# Altium schematic sheet Tray2_Comms_AFSK.SchDoc: BLUEsat AFSK Modem
size A3; DrawnBy: Mitch Wenke, Chris Webb, Thomas Fisk; Engineer: C. WEBB, M. WENKE; Organization: BLUEsat Project; Address1: Room 419; Address2: School of EE&T; Address3: UNSW, NSW 2052; Address4: Australia; DocumentNumber: COMS0002; SheetNumber: 1; SheetTotal: 1; Description: AFSK modem based on CML MX614 IC; Version: 1.0
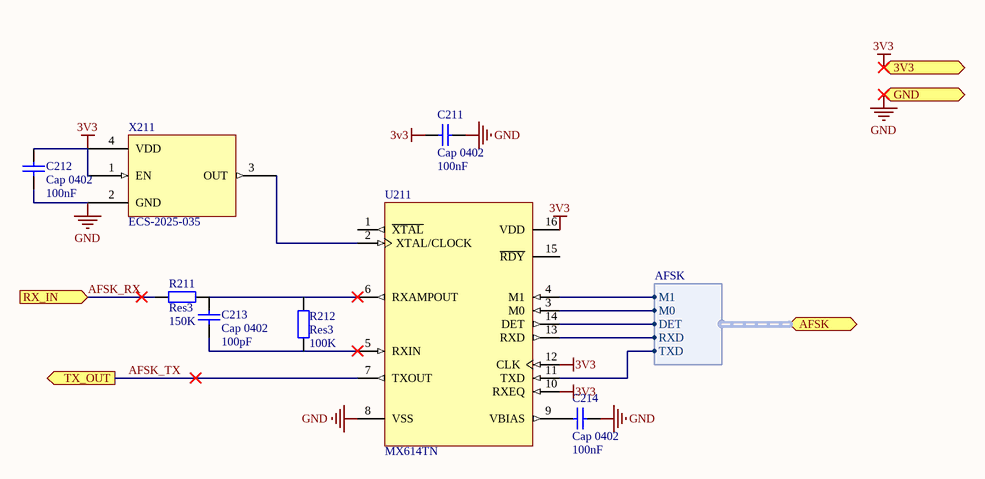
[diagram p0: Tray2_Comms_AFSK.SchDoc]

## Parts
C211  Cap 0402  value 100nF  [CAPC1005X06L]
C212  Cap 0402  value 100nF  [CAPC1005X06L]
C213  Cap 0402  value 100pF  [CAPC1005X06L]
C214  Cap 0402  value 100nF  [CAPC1005X06L]
R211  Res3  value 150K  [RESC1005X06L]
R212  Res3  value 100K  [RESC1005X06L]
U211  MX614TN  [SOIC16]
X211  ECS-2025-035  [ECS-2025]

## Ports
3V3 (in), AFSK (harness AFSK), GND (in), RX_IN (in), TX_OUT (out)

## Harnesses
AFSK: DET, M0, M1, RXD, TXD

## Nets
3V3: C211.2 C212.2 U211.10(RXEQ) U211.12(CLK) U211.16(VDD) X211.1(EN) X211.4(VDD) ; port 3V3
GND: C211.1 C212.1 C214.1 U211.8(VSS) X211.2(GND) ; port GND
AFSK_RX: R211.2 ; port RX_IN
AFSK_TX: U211.7(TXOUT) ; port TX_OUT
NetC213_1: C213.1 R212.2 U211.5(RXIN)
NetC213_2: C213.2 R211.1 R212.1 U211.6(RXAMPOUT)
NetC214_2: C214.2 U211.9(VBIAS)
NetU211_2: U211.2(XTAL/CLOCK) X211.3(OUT)
NetU211_3: U211.3(M0) ; port AFSK.M0
NetU211_4: U211.4(M1) ; port AFSK.M1
NetU211_11: U211.11(TXD) ; port AFSK.TXD
NetU211_13: U211.13(RXD) ; port AFSK.RXD
NetU211_14: U211.14(DET) ; port AFSK.DET

Not connected (* = marked no-connect by the designer): U211 1(~{XTAL}) 15(~{RDY})

## Notes on the sheet
- Title
- Description:
- Size:
- Author:
- Date:
- A3
- Time:
- Version
- Sheet:
- Drawing No.:
- of
- File:

## Library data of the parts
C211-C214 = Cap 0402: Capacitor; Published: 8-Jun-2000; LatestRevisionDate: 17-Jul-2002; LatestRevisionNote: Re-released for DXP Platform.; PackageReference: RAD-0.3; Publisher: Altium Limited; PackageDescription: Radial Cap, Thru-Hole; 2 Leads; 0.3 in Pin Spacing
R211 R212 = Res3: Resistor; Published: 8-Jun-2000; LatestRevisionDate: 29-May-2009; LatestRevisionNote: IPC-7351 Footprint Added.; PackageReference: J1-0603; Publisher: Altium Limited; PackageDescription: Chip Resistor
U211 = MX614TN: Bell 202 Compatible Modem
X211 = ECS-2025-035: SMD Clock Oscillator, 3.579545MHz